# EAGLE design adapter (EAGLE 6.6.0)
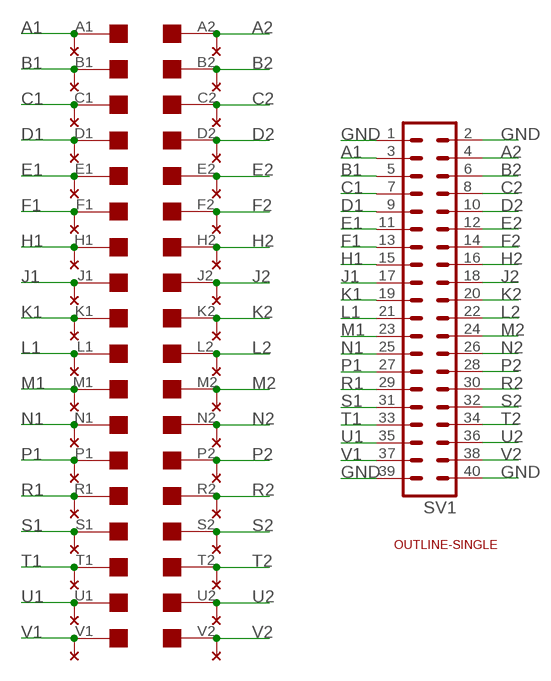
[diagram p0: schematic, sheet 1]

## Parts
EDGE1  EDGE-2CONNECTOR  [EDGE-CON2]
SV1  MA20-2  [MA20-2]
U$2  OUTLINE-SINGLE  [SINGLE]
U$3  THRU-HOLE2  [THRU-HOLEB]

## Nets
A1: EDGE1.A1 SV1.3 U$3.A1
A2: EDGE1.A2 SV1.4 U$3.A2
B1: EDGE1.B1 SV1.5 U$3.B1
B2: EDGE1.B2 SV1.6 U$3.B2
C1: EDGE1.C1 SV1.7 U$3.C1
C2: EDGE1.C2 SV1.8 U$3.C2
D1: EDGE1.D1 SV1.9 U$3.D1
D2: EDGE1.D2 SV1.10 U$3.D2
E1: EDGE1.E1 SV1.11 U$3.E1
E2: EDGE1.E2 SV1.12 U$3.E2
F1: EDGE1.F1 SV1.13 U$3.F1
F2: EDGE1.F2 SV1.14 U$3.F2
GND: SV1.1 SV1.2 SV1.39 SV1.40
H1: EDGE1.H1 SV1.15 U$3.H1
H2: EDGE1.H2 SV1.16 U$3.H2
J1: EDGE1.J1 SV1.17 U$3.J1
J2: EDGE1.J2 SV1.18 U$3.J2
K1: EDGE1.K1 SV1.19 U$3.K1
K2: EDGE1.K2 SV1.20 U$3.K2
L1: EDGE1.L1 SV1.21 U$3.L1
L2: EDGE1.L2 SV1.22 U$3.L2
M1: EDGE1.M1 SV1.23 U$3.M1
M2: EDGE1.M2 SV1.24 U$3.M2
N1: EDGE1.N1 SV1.25 U$3.N1
N2: EDGE1.N2 SV1.26 U$3.N2
P1: EDGE1.P1 SV1.27 U$3.P1
P2: EDGE1.P2 SV1.28 U$3.P2
R1: EDGE1.R1 SV1.29 U$3.R1
R2: EDGE1.R2 SV1.30 U$3.R2
S1: EDGE1.S1 SV1.31 U$3.S1
S2: EDGE1.S2 SV1.32 U$3.S2
T1: EDGE1.T1 SV1.33 U$3.T1
T2: EDGE1.T2 SV1.34 U$3.T2
U1: EDGE1.U1 SV1.35 U$3.U1
U2: EDGE1.U2 SV1.36 U$3.U2
V1: EDGE1.V1 SV1.37 U$3.V1
V2: EDGE1.V2 SV1.38 U$3.V2

## Library data of the parts
EDGE1 = dec-con:EDGE-2: Double-Sided DEC edge connector.
SV1 = con-lstb:MA20-2: PIN HEADER; OC_FARNELL: unknown; OC_NEWARK: unknown
U$2 = dec-con:OUTLINE-*: Board outlines for DEC boards.
U$3 = dec-con:THRU-HOLE2: Thru-Hole addition to double-sided edge connector.

## Board
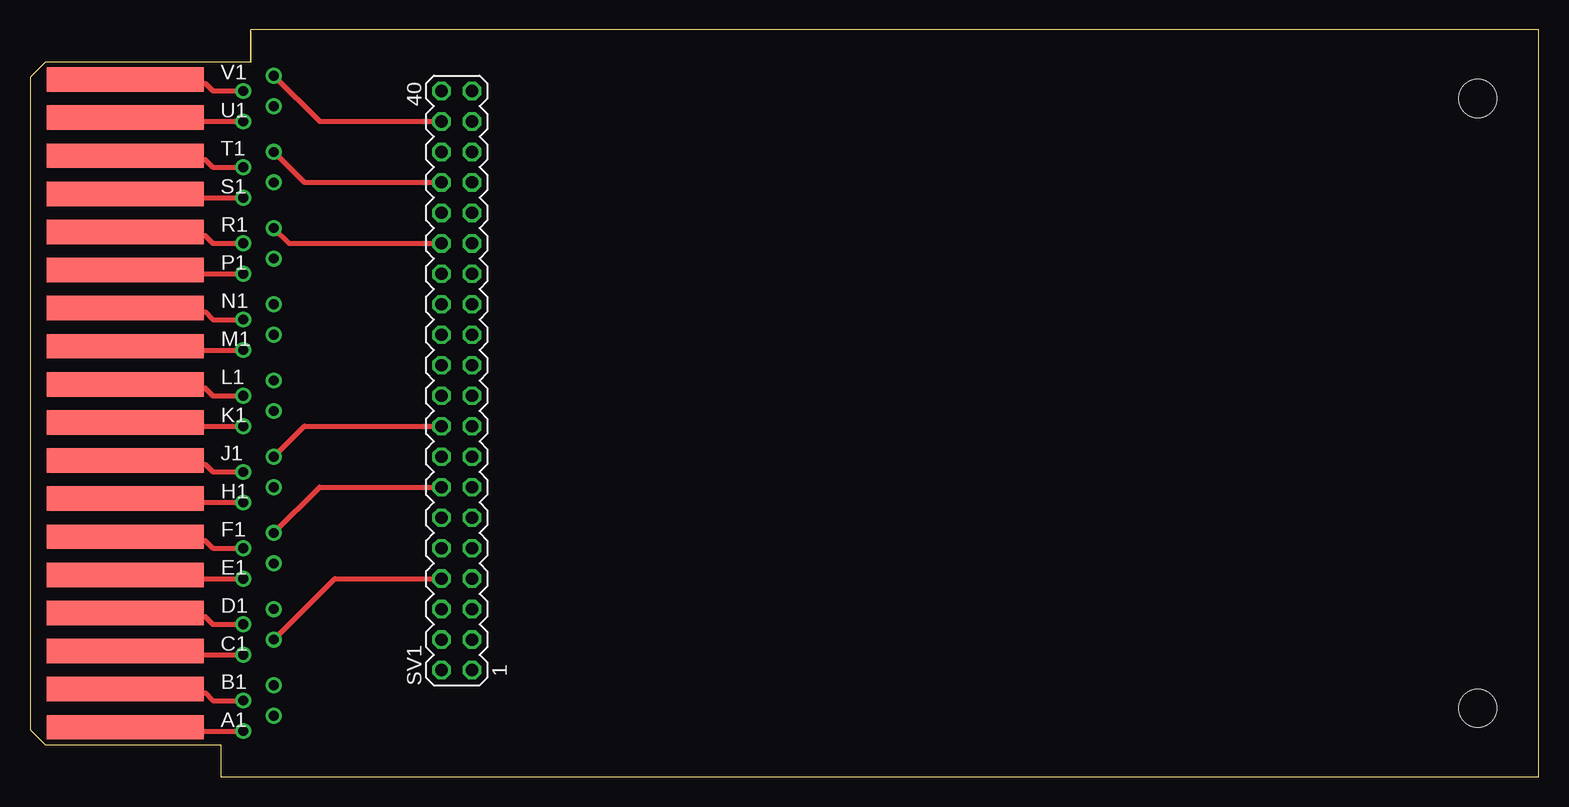
[diagram p1: board, top side]
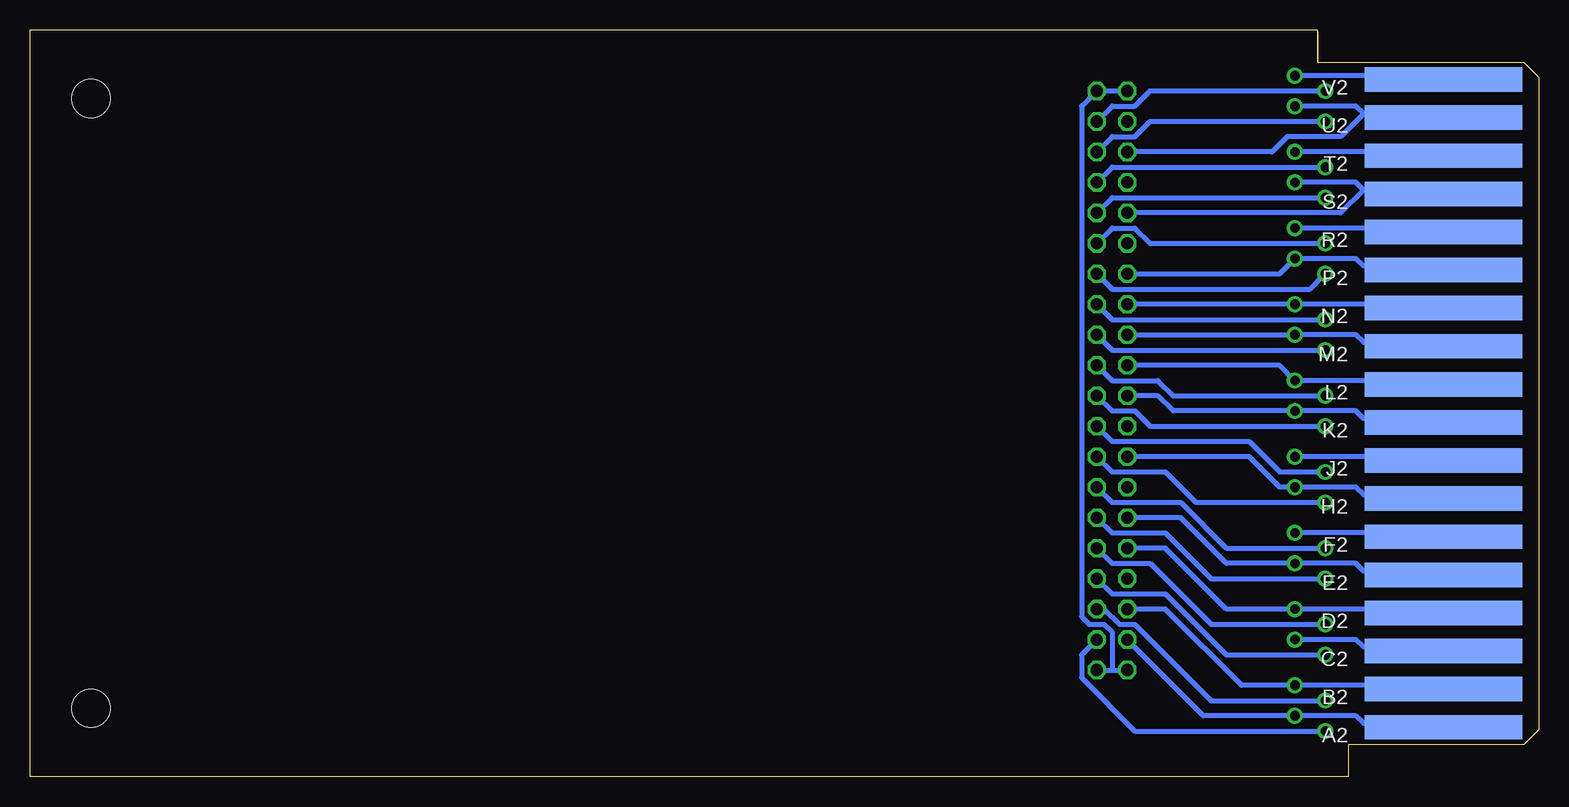
[diagram p2: board, bottom side, seen from below]

Size 125.73 x 62.23 mm. Coordinates in mm from the lower left corner, seen from the top.
Copper layers (1+16): Top 0.035mm / dielectric 1.5mm / Bottom 0.035mm
Design rules "16mils": minimum track width 16mil, minimum drill 32mil, track to track 15mil, track to pad 10mil, pad to pad 10mil, via to via 10mil, smd to smd 10mil, copper to edge 13mil, drill to drill 10mil, minimum pad ring 10mil, minimum via ring 8mil, stop-mask expansion 0mil, vias tented up to drill 0mil, thermal gap 10mil

### Footprints (pad centres in the part's own frame; a part is rotated, then mirrored left to right if it is on the bottom)
EDGE-CON2 = smd 13.106 x 2.032: A1 7.938,4.128; B1 7.938,7.303; C1 7.938,10.477; D1 7.938,13.652; E1 7.938,16.828; F1 7.938,20.003; H1 7.938,23.177; J1 7.938,26.352; K1 7.938,29.527; L1 7.938,32.703; M1 7.938,35.877; N1 7.938,39.053; P1 7.938,42.227; R1 7.938,45.403; S1 7.938,48.578; T1 7.938,51.752; U1 7.938,54.928; V1 7.938,58.102 | smd 13.106 x 2.032 bottom: A2 7.938,4.128; B2 7.938,7.303; C2 7.938,10.477; D2 7.938,13.652; E2 7.938,16.828; F2 7.938,20.003; H2 7.938,23.177; J2 7.938,26.352; K2 7.938,29.527; L2 7.938,32.703; M2 7.938,35.877; N2 7.938,39.053; P2 7.938,42.227; R2 7.938,45.403; S2 7.938,48.578; T2 7.938,51.752; U2 7.938,54.928; V2 7.938,58.102
MA20-2 = drill 1.016 octagon: 1 -24.13,-1.27; 2 -24.13,1.27; 3 -21.59,-1.27; 4 -21.59,1.27; 5 -19.05,-1.27; 6 -19.05,1.27; 7 -16.51,-1.27; 8 -16.51,1.27; 9 -13.97,-1.27; 10 -13.97,1.27; 11 -11.43,-1.27; 12 -11.43,1.27; 13 -8.89,-1.27; 14 -8.89,1.27; 15 -6.35,-1.27; 16 -6.35,1.27; 17 -3.81,-1.27; 18 -3.81,1.27; 19 -1.27,-1.27; 20 -1.27,1.27; 21 1.27,-1.27; 22 1.27,1.27; 23 3.81,-1.27; 24 3.81,1.27; 25 6.35,-1.27; 26 6.35,1.27; 27 8.89,-1.27; 28 8.89,1.27; 29 11.43,-1.27; 30 11.43,1.27; 31 13.97,-1.27; 32 13.97,1.27; 33 16.51,-1.27; 34 16.51,1.27; 35 19.05,-1.27; 36 19.05,1.27; 37 21.59,-1.27; 38 21.59,1.27; 39 24.13,-1.27; 40 24.13,1.27
SINGLE = hole 3.175: 120.65,56.515; 120.65,5.715
THRU-HOLEB = drill 0.813 pad 1.27: A1 17.78,3.81; A2 20.32,5.08; B1 17.78,6.35; B2 20.32,7.62; C1 17.78,10.16; C2 20.32,11.43; D1 17.78,12.7; D2 20.32,13.97; E1 17.78,16.51; E2 20.32,17.78; F1 17.78,19.05; F2 20.32,20.32; H1 17.78,22.86; H2 20.32,24.13; J1 17.78,25.4; J2 20.32,26.67; K1 17.78,29.21; K2 20.32,30.48; L1 17.78,31.75; L2 20.32,33.02; M1 17.78,35.56; M2 20.32,36.83; N1 17.78,38.1; N2 20.32,39.37; P1 17.78,41.91; P2 20.32,43.18; R1 17.78,44.45; R2 20.32,45.72; S1 17.78,48.26; S2 20.32,49.53; T1 17.78,50.8; T2 20.32,52.07; U1 17.78,54.61; U2 20.32,55.88; V1 17.78,57.15; V2 20.32,58.42

### Placement (x,y rotation side)
EDGE1  0,0 0 top
SV1  35.56,33.02 90 top
U$2  0,0 0 top
U$3  0,0 0 top

### Tracks (layer width: path | path; a pad name or v marks a point on that pad's centre or on a via)
A1
  Top 0.406: U$3.A1 8.26,3.81 EDGE1.A1
  Bottom 0.406: U$3.A1 33.66,3.81 38.1,8.26 38.1,10.16 SV1.3
A2
  Bottom 0.406: EDGE1.A2 8.26,4.45 14.61,4.45 15.24,5.08 U$3.A2 27.94,5.08 SV1.4
B1
  Top 0.406: U$3.B1 15.24,6.35 14.61,6.99 8.26,6.99 EDGE1.B1
  Bottom 0.406: U$3.B1 27.31,6.35 33.66,12.7 34.93,12.7 36.2,13.97 SV1.5
B2
  Bottom 0.406: EDGE1.B2 8.26,7.62 U$3.B2 24.77,7.62 31.12,13.97 SV1.6
C1
  Top 0.406: U$3.C1 8.26,10.16 EDGE1.C1
  Bottom 0.406: U$3.C1 26.04,10.16 31.12,15.24 35.56,15.24 SV1.7
C2
  Top 0.406: SV1.8 25.4,16.51 U$3.C2
  Bottom 0.406: U$3.C2 15.24,11.43 14.61,10.79 8.26,10.79 EDGE1.C2
D1
  Top 0.406: U$3.D1 15.24,12.7 14.61,13.34 8.26,13.34 EDGE1.D1
  Bottom 0.406: U$3.D1 27.31,12.7 32.39,17.78 35.56,17.78 SV1.9
D2
  Bottom 0.406: EDGE1.D2 8.26,13.97 U$3.D2 26.04,13.97 31.12,19.05 SV1.10
E1
  Top 0.406: U$3.E1 8.26,16.51 EDGE1.E1
  Bottom 0.406: U$3.E1 27.31,16.51 31.12,20.32 35.56,20.32 SV1.11
E2
  Bottom 0.406: EDGE1.E2 8.26,17.14 14.61,17.14 15.24,17.78 U$3.E2 26.04,17.78 29.85,21.59 SV1.12
F1
  Top 0.406: U$3.F1 15.24,19.05 14.61,19.68 8.26,19.68 EDGE1.F1
  Bottom 0.406: U$3.F1 26.04,19.05 29.85,22.86 35.56,22.86 SV1.13
F2
  Top 0.406: SV1.14 24.13,24.13 U$3.F2
  Bottom 0.406: U$3.F2 8.26,20.32 EDGE1.F2
GND
  Bottom 0.406: SV1.1 35.56,8.89 | 35.56,8.89 SV1.2 | SV1.40 SV1.39 38.1,55.88 38.1,13.34 37.47,12.7 36.2,12.7 35.56,12.06 35.56,8.89
H1
  Top 0.406: U$3.H1 8.26,22.86 EDGE1.H1
  Bottom 0.406: U$3.H1 28.58,22.86 31.12,25.4 35.56,25.4 SV1.15
H2
  Bottom 0.406: EDGE1.H2 8.26,23.5 14.61,23.5 15.24,24.13 U$3.H2 21.59,24.13 24.13,26.67 SV1.16
J1
  Top 0.406: U$3.J1 15.24,25.4 14.61,26.04 8.26,26.04 EDGE1.J1
  Bottom 0.406: U$3.J1 21.59,25.4 24.13,27.94 35.56,27.94 SV1.17
J2
  Top 0.406: SV1.18 22.86,29.21 U$3.J2
  Bottom 0.406: U$3.J2 8.26,26.67 EDGE1.J2
K1
  Top 0.406: U$3.K1 8.26,29.21 EDGE1.K1
  Bottom 0.406: U$3.K1 32.39,29.21 33.66,30.48 35.56,30.48 SV1.19
K2
  Bottom 0.406: EDGE1.K2 8.26,29.84 14.61,29.84 15.24,30.48 U$3.K2 30.48,30.48 31.75,31.75 SV1.20
L1
  Top 0.406: U$3.L1 15.24,31.75 14.61,32.38 8.26,32.38 EDGE1.L1
  Bottom 0.406: U$3.L1 30.48,31.75 31.75,33.02 35.56,33.02 SV1.21
L2
  Bottom 0.406: EDGE1.L2 8.26,33.02 U$3.L2 21.59,34.29 SV1.22
M1
  Top 0.406: U$3.M1 8.26,35.56 EDGE1.M1
  Bottom 0.406: U$3.M1 35.56,35.56 SV1.23
M2
  Bottom 0.406: SV1.24 U$3.M2 15.24,36.83 14.61,36.2 8.26,36.2 EDGE1.M2
N1
  Top 0.406: U$3.N1 15.24,38.1 14.61,38.73 8.26,38.73 EDGE1.N1
  Bottom 0.406: U$3.N1 35.56,38.1 SV1.25
N2
  Bottom 0.406: EDGE1.N2 8.26,39.37 U$3.N2 SV1.26
P1
  Top 0.406: U$3.P1 8.26,41.91 EDGE1.P1
  Bottom 0.406: U$3.P1 19.05,40.64 35.56,40.64 SV1.27
P2
  Bottom 0.406: SV1.28 21.59,41.91 U$3.P2 15.24,43.18 14.61,42.55 8.26,42.55 EDGE1.P2
R1
  Top 0.406: U$3.R1 15.24,44.45 14.61,45.09 8.26,45.09 EDGE1.R1
  Bottom 0.406: U$3.R1 32.39,44.45 33.66,45.72 35.56,45.72 SV1.29
R2
  Top 0.406: SV1.30 21.59,44.45 U$3.R2
  Bottom 0.406: U$3.R2 8.26,45.72 EDGE1.R2
S1
  Top 0.406: U$3.S1 8.26,48.26 EDGE1.S1
  Bottom 0.406: U$3.S1 35.56,48.26 SV1.31
S2
  Bottom 0.406: U$3.S2 15.24,49.53 14.61,48.9 | 14.61,48.9 8.26,48.9 EDGE1.S2 | SV1.32 16.51,46.99 14.61,48.9
T1
  Top 0.406: U$3.T1 15.24,50.8 14.61,51.44 8.26,51.44 EDGE1.T1
  Bottom 0.406: U$3.T1 35.56,50.8 SV1.33
T2
  Top 0.406: SV1.34 22.86,49.53 U$3.T2
  Bottom 0.406: U$3.T2 8.26,52.07 EDGE1.T2
U1
  Top 0.406: U$3.U1 8.26,54.61 EDGE1.U1
  Bottom 0.406: U$3.U1 32.39,54.61 33.66,53.34 35.56,53.34 SV1.35
U2
  Bottom 0.406: U$3.U2 15.24,55.88 14.61,55.24 | 14.61,55.24 8.26,55.24 EDGE1.U2 | SV1.36 22.23,52.07 20.96,53.34 16.51,53.34 14.61,55.24
V1
  Top 0.406: U$3.V1 15.24,57.15 14.61,57.78 8.26,57.78 EDGE1.V1
  Bottom 0.406: U$3.V1 32.39,57.15 33.66,55.88 35.56,55.88 SV1.37
V2
  Top 0.406: SV1.38 24.13,54.61 U$3.V2
  Bottom 0.406: U$3.V2 8.26,58.42 EDGE1.V2